# EAGLE design 6in-6out_1.0 (EAGLE 5.02)
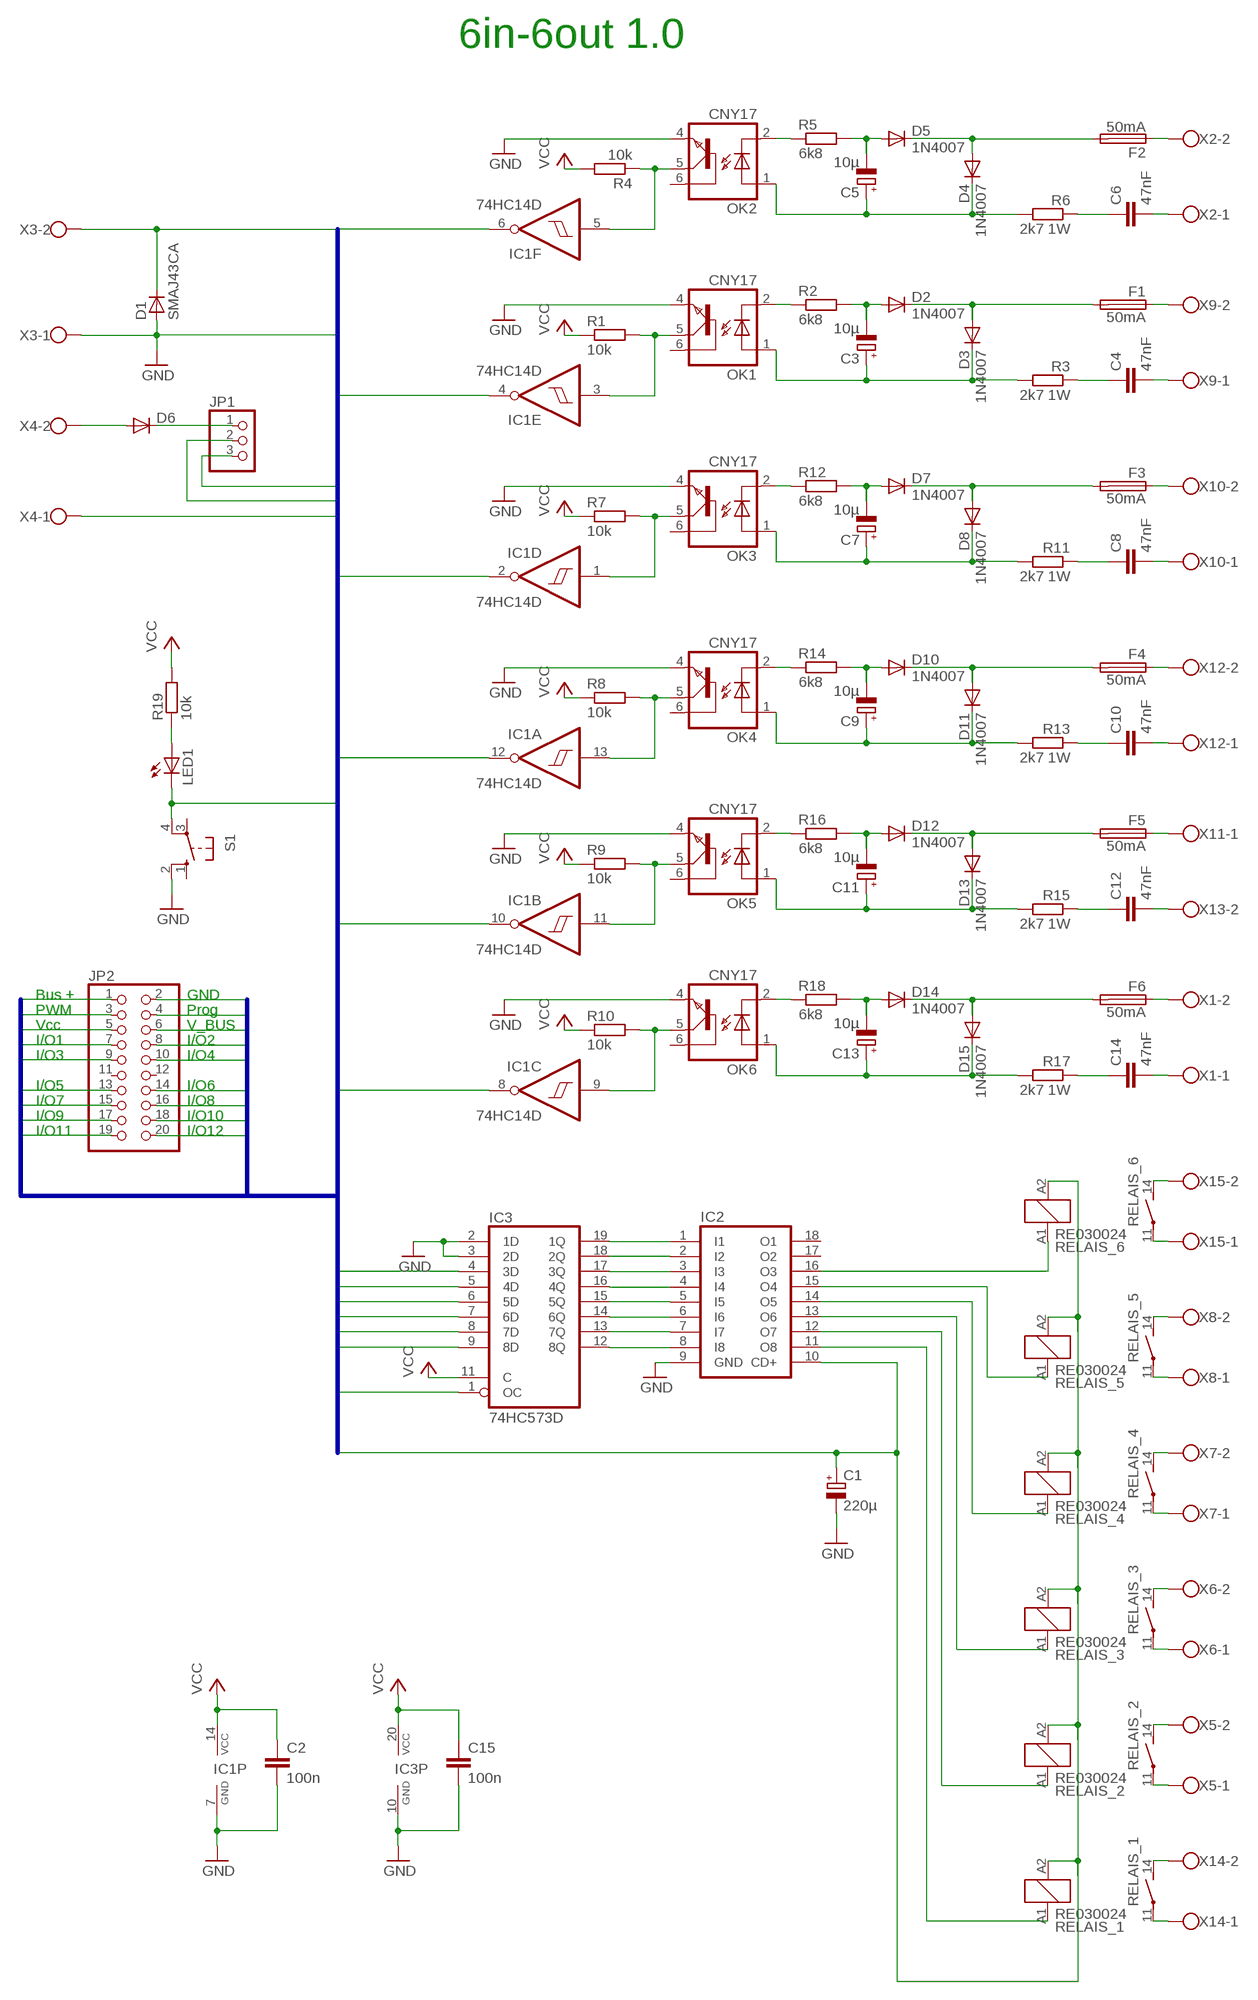
[diagram p0: schematic, sheet 1]

## Parts
C1  220µ  CPOL-EUE3.5-10  [E3,5-10]
C2  100n  C-EUC1206  [C1206]
C3  10µ  CPOL-EUE2-4  [E2-4]
C4  47nF  C-EU075-063X106  [C075-063X106]
C5  10µ  CPOL-EUE2-4  [E2-4]
C6  47nF  C-EU075-063X106  [C075-063X106]
C7  10µ  CPOL-EUE2-4  [E2-4]
C8  47nF  C-EU075-063X106  [C075-063X106]
C9  10µ  CPOL-EUE2-4  [E2-4]
C10  47nF  C-EU075-063X106  [C075-063X106]
C11  10µ  CPOL-EUE2-4  [E2-4]
C12  47nF  C-EU075-063X106  [C075-063X106]
C13  10µ  CPOL-EUE2-4  [E2-4]
C14  47nF  C-EU075-063X106  [C075-063X106]
C15  100n  C-EUC1206  [C1206]
D1  SMAJ43CA  D-SMB  [SMB]
D2  1N4007  DIODE-D-2.5  [D-2.5]
D3  1N4007  DIODE-D-2.5  [D-2.5]
D4  1N4007  DIODE-D-2.5  [D-2.5]
D5  1N4007  DIODE-D-2.5  [D-2.5]
D6  DIODE-MINIMELF  [MINIMELF]
D7  1N4007  DIODE-D-2.5  [D-2.5]
D8  1N4007  DIODE-D-2.5  [D-2.5]
D10  1N4007  DIODE-D-2.5  [D-2.5]
D11  1N4007  DIODE-D-2.5  [D-2.5]
D12  1N4007  DIODE-D-2.5  [D-2.5]
D13  1N4007  DIODE-D-2.5  [D-2.5]
D14  1N4007  DIODE-D-2.5  [D-2.5]
D15  1N4007  DIODE-D-2.5  [D-2.5]
F1  50mA  FUSE  [0617V]
F2  50mA  FUSE  [0617V]
F3  50mA  FUSE  [0617V]
F4  50mA  FUSE  [0617V]
F5  50mA  FUSE  [0617V]
F6  50mA  FUSE  [0617V]
IC1  74HC14D  [SO14]
IC2  ULN2803AD  [SO18W]
IC3  74HC573D  [SO20W]
JP1  PINHD-1X3  [1X03]
JP2  PINHD-2X10  [2X10]
LED1  LED3MM  [LED3MM]
OK1  CNY17  [DIL06]
OK2  CNY17  [DIL06]
OK3  CNY17  [DIL06]
OK4  CNY17  [DIL06]
OK5  CNY17  [DIL06]
OK6  CNY17  [DIL06]
R1  10k  R-EU_M1206  [M1206]
R2  6k8  R-EU_0207/2V  [0207/2V]
R3  2k7 1W  R-EU_0207/2V  [0207/2V]
R4  10k  R-EU_M1206  [M1206]
R5  6k8  R-EU_0207/2V  [0207/2V]
R6  2k7 1W  R-EU_0207/2V  [0207/2V]
R7  10k  R-EU_M1206  [M1206]
R8  10k  R-EU_M1206  [M1206]
R9  10k  R-EU_M1206  [M1206]
R10  10k  R-EU_M1206  [M1206]
R11  2k7 1W  R-EU_0207/2V  [0207/2V]
R12  6k8  R-EU_0207/2V  [0207/2V]
R13  2k7 1W  R-EU_0207/2V  [0207/2V]
R14  6k8  R-EU_0207/2V  [0207/2V]
R15  2k7 1W  R-EU_0207/2V  [0207/2V]
R16  6k8  R-EU_0207/2V  [0207/2V]
R17  2k7 1W  R-EU_0207/2V  [0207/2V]
R18  6k8  R-EU_0207/2V  [0207/2V]
R19  10k  R-EU_M1206  [M1206]
RELAIS_1  RE030024  [RE-SCHRACK]
RELAIS_2  RE030024  [RE-SCHRACK]
RELAIS_3  RE030024  [RE-SCHRACK]
RELAIS_4  RE030024  [RE-SCHRACK]
RELAIS_5  RE030024  [RE-SCHRACK]
RELAIS_6  RE030024  [RE-SCHRACK]
S1  10-XX  [B3F-10XX]
X1  W237-02P  [W237-132]
X2  W237-3E  [W237-3E]
X3  W237-02P  [W237-132]
X4  W237-02P  [W237-132]
X5  W237-02P  [W237-132]
X6  W237-02P  [W237-132]
X7  W237-02P  [W237-132]
X8  W237-02P  [W237-132]
X9  W237-3E  [W237-3E]
X10  W237-3E  [W237-3E]
X11  W237-02P  [W237-132]
X12  W237-02P  [W237-132]
X13  W237-02P  [W237-132]
X14  W237-02P  [W237-132]
X15  W237-02P  [W237-132]

## Nets
EIB+: D1.1(C) JP2.1 X3.2
GND: C1.- C2.2 C15.2 D1.2(A) IC1.7(P:GND) IC2.9(GND) IC3.2(1D) IC3.3(2D) IC3.10(GND) JP2.2 OK1.4(EMI) OK2.4(EMI) OK3.4(EMI) OK4.4(EMI) OK5.4(EMI) OK6.4(EMI) S1.2(S1) X3.1 X4.1
IO1: IC3.4(3D) JP2.7
IO2: IC3.5(4D) JP2.8
IO3: IC3.6(5D) JP2.9
IO4: IC3.7(6D) JP2.10
IO5: IC3.8(7D) JP2.13
IO6: IC3.9(8D) JP2.14
IO7: IC1.6(F:O) JP2.15
IO8: IC1.4(E:O) JP2.16
IO9: IC1.2(D:O) JP2.17
IO10: IC1.12(A:O) JP2.18
IO11: IC1.10(B:O) JP2.19
IO12: IC1.8(C:O) JP2.20
N$1: OK1.2(C) R2.1
N$2: LED1.A R19.1
N$3: C3.- D2.A R2.2
N$4: OK3.2(C) R12.1
N$5: D2.C D3.A F1.2
N$6: RELAIS_6.14(2:S) X15.2
N$7: C4.1 R3.1
N$8: C7.- D7.A R12.2
N$9: D7.C D8.A F3.2
N$10: OK2.2(C) R5.1
N$11: C6.1 R6.1
N$12: D6.A X4.2
N$13: C5.- D5.A R5.2
N$14: IC2.16(O3) RELAIS_6.A1
N$15: D6.C JP1.1
N$17: IC2.15(O4) RELAIS_5.A1
N$18: D4.A D5.C F2.2
N$19: IC2.12(O7) RELAIS_2.A1
N$20: C5.+ D4.C OK2.1(A) R6.2
N$21: IC2.1(I1) IC3.19(1Q)
N$22: IC2.2(I2) IC3.18(2Q)
N$23: C7.+ D8.C OK3.1(A) R11.2
N$24: C3.+ D3.C OK1.1(A) R3.2
N$25: RELAIS_6.11(2:P) X15.1
N$26: RELAIS_5.14(2:S) X8.2
N$27: IC1.1(D:I) OK3.5(COL) R7.2
N$28: IC1.5(F:I) OK2.5(COL) R4.1
N$29: IC1.3(E:I) OK1.5(COL) R1.2
N$30: RELAIS_5.11(2:P) X8.1
N$31: C8.1 R11.1
N$32: RELAIS_4.14(2:S) X7.2
N$33: OK4.2(C) R14.1
N$34: C9.- D10.A R14.2
N$35: D10.C D11.A F4.2
N$36: C9.+ D11.C OK4.1(A) R13.2
N$37: IC1.13(A:I) OK4.5(COL) R8.2
N$38: C10.1 R13.1
N$39: RELAIS_4.11(2:P) X7.1
N$40: RELAIS_3.14(2:S) X6.2
N$41: OK5.2(C) R16.1
N$42: C11.- D12.A R16.2
N$43: D12.C D13.A F5.2
N$44: C11.+ D13.C OK5.1(A) R15.2
N$45: IC1.11(B:I) OK5.5(COL) R9.2
N$46: RELAIS_3.11(2:P) X6.1
N$47: RELAIS_2.14(2:S) X5.2
N$48: C12.1 R15.1
N$49: OK6.2(C) R18.1
N$50: C13.- D14.A R18.2
N$51: D14.C D15.A F6.2
N$52: C13.+ D15.C OK6.1(A) R17.2
N$53: IC1.9(C:I) OK6.5(COL) R10.2
N$54: RELAIS_2.11(2:P) X5.1
N$55: RELAIS_1.14(2:S) X14.2
N$56: C14.1 R17.1
N$57: RELAIS_1.11(2:P) X14.1
N$58: F1.1 X9.2
N$59: IC2.3(I3) IC3.17(3Q)
N$60: IC2.13(O6) RELAIS_3.A1
N$61: IC2.4(I4) IC3.16(4Q)
N$62: F2.1 X2.2
N$63: C6.2 X2.1
N$64: IC2.5(I5) IC3.15(5Q)
N$65: IC2.14(O5) RELAIS_4.A1
N$66: IC2.6(I6) IC3.14(6Q)
N$67: C4.2 X9.1
N$68: F3.1 X10.2
N$69: IC2.7(I7) IC3.13(7Q)
N$70: IC2.8(I8) IC3.12(8Q)
N$71: C8.2 X10.1
N$72: F4.1 X12.2
N$73: C10.2 X12.1
N$74: C12.2 X13.2
N$75: F5.1 X11.1
N$76: F6.1 X1.2
N$77: C14.2 X1.1
PROG: JP2.4 LED1.K(C) S1.4(P1)
PWM: IC3.1(OC) JP2.3
R3: IC2.11(O8) RELAIS_1.A1
V_BUS: JP1.3 JP2.6
VCC: C2.1 C15.1 IC1.14(P:VCC) IC3.11(C) IC3.20(VCC) JP2.5 R1.1 R4.2 R7.1 R8.1 R9.1 R10.1 R19.2
VDD: C1.+ IC2.10(CD+) JP1.2 RELAIS_1.A2 RELAIS_2.A2 RELAIS_3.A2 RELAIS_4.A2 RELAIS_5.A2 RELAIS_6.A2
Unconnected: IC2.17(O2) IC2.18(O1) JP2.11 JP2.12 OK1.6(BAS) OK2.6(BAS) OK3.6(BAS) OK4.6(BAS) OK5.6(BAS) OK6.6(BAS) S1.1(S) S1.3(P) X2.3 X9.3 X10.3 X11.2 X13.1

## Buses
IO[1..12],PWM,PROG,VDD,VCC,GND,EIB+,V_BUS

## Notes on the sheet
- 6in-6out 1.0
- Bus + | GND
- PWM | Prog
- Vcc | V_BUS
- I/O1 | I/O2
- I/O3 | I/O4
- I/O5 | I/O6
- I/O7 | I/O8
- I/O9 | I/O10
- I/O11 | I/O12

## Library data of the parts
C1 C3 C5 C7 C9 C11 C13 = rcl:CPOL-EU: POLARIZED CAPACITOR, European symbol
C2 C4 C6 C8 C10 C12 C14 C15 = rcl:C-EU: CAPACITOR, European symbol
D1 = semicon-smd-ipc:D-: DIODE unfilled
D2-D8 D10-D15 = diode:DIODE-: DIODE
F1-F6 = fuse:FUSE: Fuse
IC1 = 74xx-eu:74*14: Hex schmitt trigger INVERTER
IC2 = uln-udn:ULN2803A: DRIVER ARRAY
IC3 = 74xx-eu:74*573: 8-bit D latch BUS DRIVER
JP1 = pinhead:PINHD-1X3: PIN HEADER
JP2 = pinhead:PINHD-2X10: PIN HEADER
LED1 = led:LED: LED OSRAM: - CHIPLED LG R971, LG N971, LY N971, LG Q971, LY Q971, LO R971, LY R971 LH N974, LH R974 LS Q976, LO Q976, LY Q976 LO Q996 - Hyper CHIPLED LW Q18S LB Q993, LB Q99A, LB R99A - SideLED LS A670, LO A670, LY A670, LG A670, LP A670 LB A673, LV A673, LT A673, LW A673 LH A674 LY A675 LS A676, LA A676, LO A676, LY A676, LW A676 LS A679, LY A679, LG A679 - Hyper Micro SIDELED® LS Y876, LA Y876, LO Y876, LY Y876 LT Y87S - SmartLED LW L88C, LW L88S LB L89C, LB L89S, LG L890 LS L89K, LO L89K, LY L89K LS L896, LA L896, LO L896, LY L896 - TOPLED LS T670, LO T670, LY T670, LG T670, LP T670 LSG T670, LSP T670, LSY T670, LOP T670, LYG T670 LG T671, LOG T671, LSG T671 LB T673, LV T673, LT T673, LW T673 LH T674 LS T676, LA T676, LO T676, LY T676, LB T676, LH T676, LSB T676, LW T676 LB T67C, LV T67C, LT T67C, LS T67K, LO T67K, LY T67K, LW E67C LS E67B, LA E67B, LO E67B, LY E67B, LB E67C, LV E67C, LT E67C LW T67C LS T679, LY T679, LG T679 LS T770, LO T770, LY T770, LG T770, LP T770 LB T773, LV T773, LT T773, LW T773 LH T774 LS E675, LA E675, LY E675, LS T675 LS T776, LA T776, LO T776, LY T776, LB T776 LHGB T686 LT T68C, LB T68C - Hyper Mini TOPLED® LB M676 - Mini TOPLED Santana® LG M470 LS M47K, LO M47K, LY M47K Source: http://www.osram.convergy.de - LUMILED® LXK2-PW12-R00, LXK2-PW12-S00, LXK2-PW14-U00, LXK2-PW14-V00 LXK2-PM12-R00, LXK2-PM12-S00, LXK2-PM14-U00 LXK2-PE12-Q00, LXK2-PE12-R00, LXK2-PE12-S00, LXK2-PE14-T00, LXK2-PE14-U00 LXK2-PB12-K00, LXK2-PB12-L00, LXK2-PB12-M00, LXK2-PB14-N00, LXK2-PB14-P00, LXK2-PB14-Q00 LXK2-PR12-L00, LXK2-PR12-M00, LXK2-PR14-Q00, LXK2-PR14-R00 LXK2-PD12-Q00, LXK2-PD12-R00, LXK2-PD12-S00 LXK2-PH12-R00, LXK2-PH12-S00 LXK2-PL12-P00, LXK2-PL12-Q00, LXK2-PL12-R00 Source: www.luxeon.com
OK1-OK6 = optocoupler:CNY17: SIEMENS OPTO COUPLER
R1-R19 = rcl:R-EU_: RESISTOR, European symbol
RELAIS_1-RELAIS_6 = relay:RE03*: Miniature PCB Relay 1 pole 6 A SCHRACK Source: http://www.schrack.com/.. 5812.pdf
S1 = switch-omron:10-XX: OMRON SWITCH
X1 X3-X8 X11-X15 = con-wago-508:W237-02P: WAGO SREW CLAMP
X2 X9 X10 = con-wago-508:W237-3E: WAGO SREW CLAMP

## Board
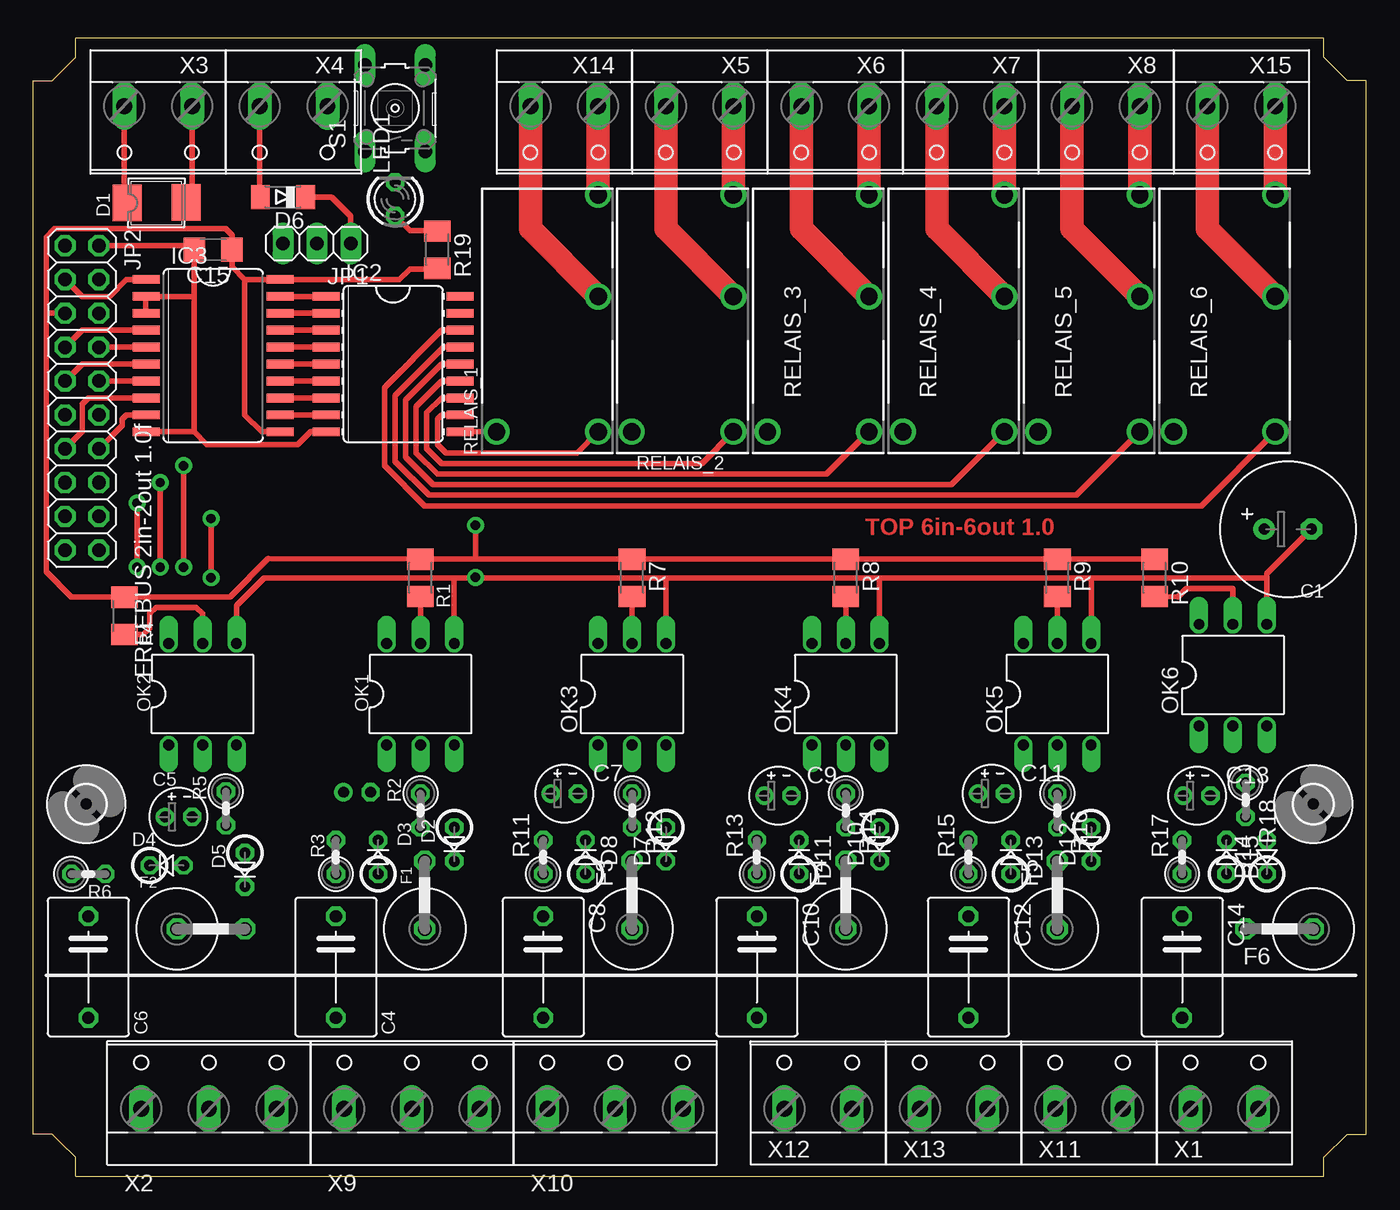
[diagram p1: board, top side]
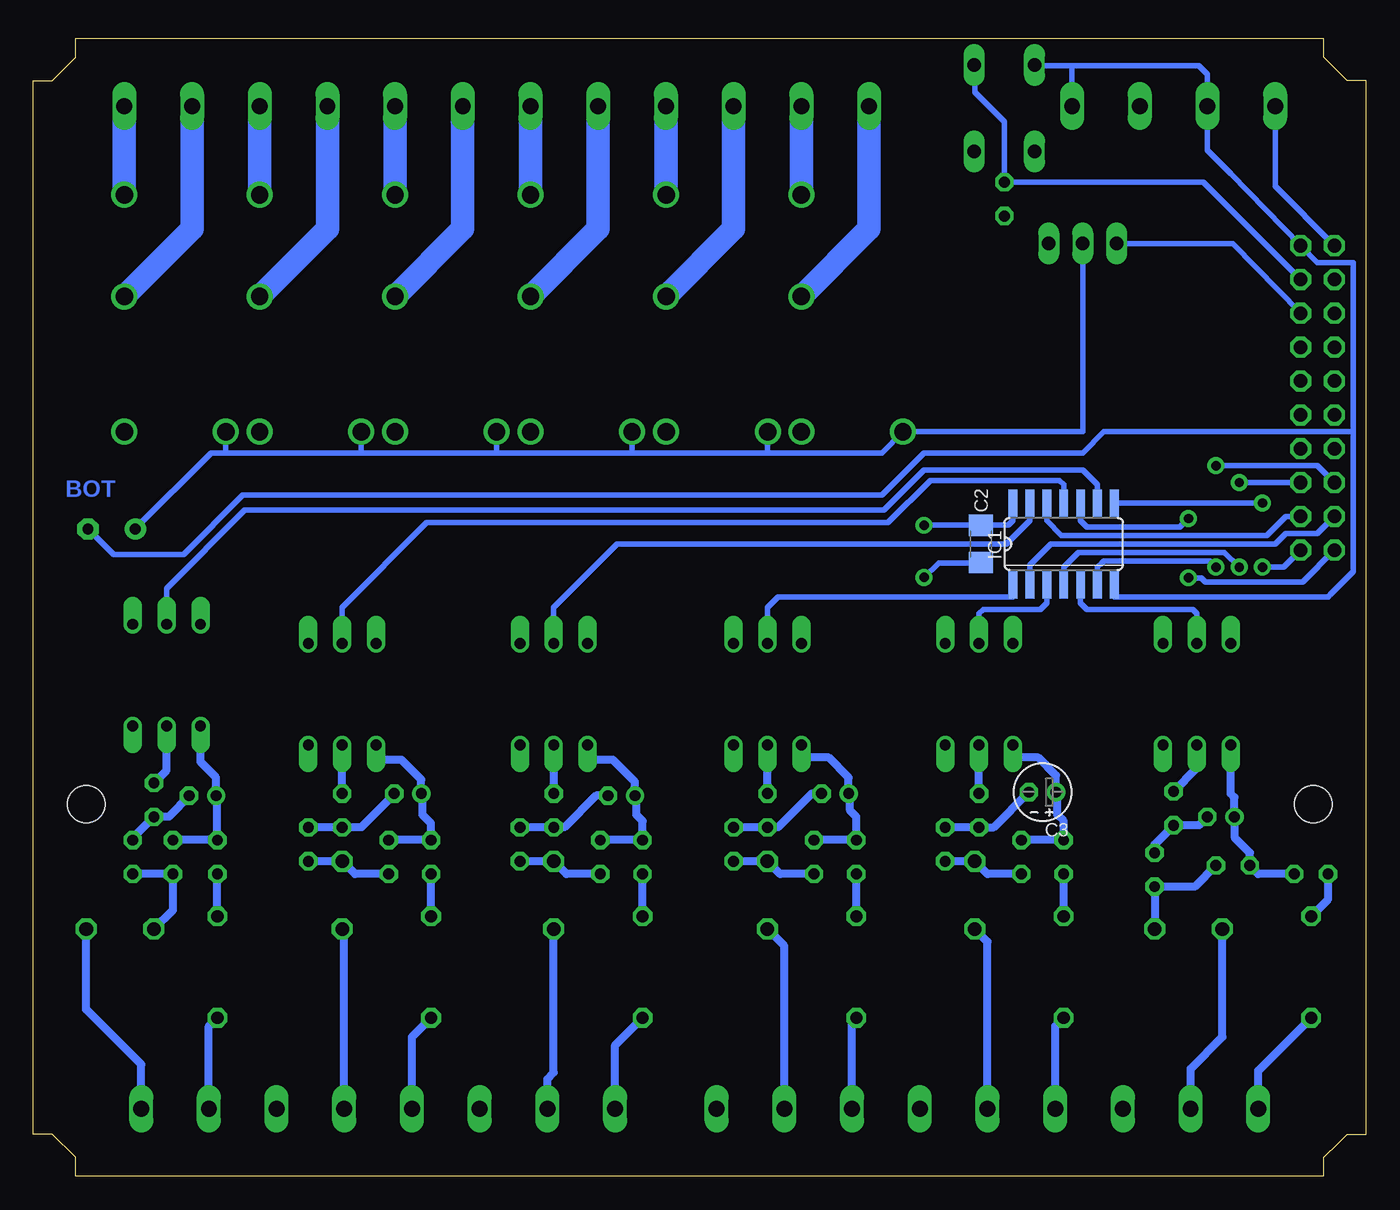
[diagram p2: board, bottom side, seen from below]

Size 100.01 x 85.41 mm. Coordinates in mm from the lower left corner, seen from the top.
Outline: 3.17,0 3.17,1.43 2.06,2.54 1.43,3.17 0,3.17 0,82.23 1.43,82.23 2.22,83.03 3.17,83.98 3.17,85.41 96.84,85.41 96.84,83.98 98.58,82.23 100.01,82.23 100.01,3.17 98.58,3.17 96.84,1.43 96.84,0 3.17,0
Copper layers (1*16): Top 0.035mm / dielectric 1.5mm / Bottom 0.035mm
Design rules "default_freebus": minimum track width 10mil, minimum drill 24mil, track to track 8mil, track to pad 8mil, pad to pad 8mil, via to via 8mil, smd to smd 8mil, copper to edge 12mil, drill to drill 8mil, minimum pad ring 11mil, minimum via ring 8mil, stop-mask expansion 4mil, vias tented up to drill 0mil, thermal gap 10mil

### Footprints (pad centres in the part's own frame; a part is rotated, then mirrored left to right if it is on the bottom)
E3,5-10 = drill 0.813 pad 1.6 round: + -1.778,0 | drill 0.813 pad 1.6 octagon: - 1.778,0
C1206 = smd 1.6 x 1.8: 1 -1.4,0; 2 1.4,0
E2-4 = drill 0.813 pad 1.27 round: + -1.016,0 | drill 0.813 pad 1.27 octagon: - 1.016,0
C075-063X106 = drill 0.914 octagon: 1 -3.81,0; 2 3.81,0
SMB = smd 2.159 x 2.743: 1 -2.311,-0.127; 2 2.108,-0.102
D-2.5 = drill 0.813 octagon: A 1.27,0; C -1.27,0
MINIMELF = smd 1.4 x 1.8: A 1.7,0; C -1.7,0
0617V = drill 1.016 octagon: 1 -2.54,0; 2 2.54,0
SO14 = smd 0.66 x 2.032: 1 -3.81,-3.073; 2 -2.54,-3.073; 3 -1.27,-3.073; 4 0,-3.073; 5 1.27,-3.073; 6 2.54,-3.073; 7 3.81,-3.073; 8 3.81,3.073; 9 2.54,3.073; 10 1.27,3.073; 11 0,3.073; 12 -1.27,3.073; 13 -2.54,3.073; 14 -3.81,3.073
SO18W = smd 0.66 x 2.032: 1 -5.08,-5.029; 2 -3.81,-5.029; 3 -2.54,-5.029; 4 -1.27,-5.029; 5 0,-5.029; 6 1.27,-5.029; 7 2.54,-5.029; 8 3.81,-5.029; 9 5.08,-5.029; 10 5.08,5.029; 11 3.81,5.029; 12 2.54,5.029; 13 1.27,5.029; 14 0,5.029; 15 -1.27,5.029; 16 -2.54,5.029; 17 -3.81,5.029; 18 -5.08,5.029
SO20W = smd 0.66 x 2.032: 1 -5.715,-5.029; 2 -4.445,-5.029; 3 -3.175,-5.029; 4 -1.905,-5.029; 5 -0.635,-5.029; 6 0.635,-5.029; 7 1.905,-5.029; 8 3.175,-5.029; 9 4.445,-5.029; 10 5.715,-5.029; 11 5.715,5.029; 12 4.445,5.029; 13 3.175,5.029; 14 1.905,5.029; 15 0.635,5.029; 16 -0.635,5.029; 17 -1.905,5.029; 18 -3.175,5.029; 19 -4.445,5.029; 20 -5.715,5.029
1X03 = drill 1.016 long: 1 -2.54,0; 2 0,0; 3 2.54,0
2X10 = drill 1.016 octagon: 1 -11.43,-1.27; 2 -11.43,1.27; 3 -8.89,-1.27; 4 -8.89,1.27; 5 -6.35,-1.27; 6 -6.35,1.27; 7 -3.81,-1.27; 8 -3.81,1.27; 9 -1.27,-1.27; 10 -1.27,1.27; 11 1.27,-1.27; 12 1.27,1.27; 13 3.81,-1.27; 14 3.81,1.27; 15 6.35,-1.27; 16 6.35,1.27; 17 8.89,-1.27; 18 8.89,1.27; 19 11.43,-1.27; 20 11.43,1.27
LED3MM = drill 0.813 octagon: A -1.27,0; K 1.27,0
DIL06 = drill 0.813 offset: 1 -2.54,-3.81; 2 0,-3.81; 3 2.54,-3.81; 4 2.54,3.81; 5 0,3.81; 6 -2.54,3.81
M1206 = smd 1.6 x 2: 1 -1.4,0; 2 1.4,0
0207/2V = drill 0.813 octagon: 1 -1.27,0; 2 1.27,0
RE-SCHRACK = drill 1.3 round: 11 8.89,-3.81; 14 1.27,-3.81; A1 -8.89,-3.81; A2 -8.89,3.81
B3F-10XX = drill 1.016 long: 1 -3.251,2.261; 2 3.251,2.261; 3 -3.251,-2.261; 4 3.251,-2.261
2,8 = hole 2.8: 0,0
W237-132 = drill 1.194 long: 1 -2.54,-0.635; 2 2.54,-0.635
W237-3E = drill 1.194 long: 1 -5.08,-0.635; 2 0,-0.635; 3 5.08,-0.635

### Placement (x,y rotation side)
C1  94.14,48.58 0 top
C2  28.89,47.47 270 bottom
C3  24.29,28.84 180 bottom
C4  22.7,15.72 270 top
C5  10.9,26.99 0 top
C6  4.13,15.72 270 top
C7  39.85,28.73 0 top
C8  38.26,15.72 270 top
C9  55.88,28.58 0 top
C10  54.29,15.72 270 top
C11  71.91,28.73 0 top
C12  70.17,15.72 270 top
C13  87.31,28.58 0 top
C14  86.2,15.72 270 top
C15  13.49,69.53 180 top
D1  9.37,73.18 0 top
D2  31.59,24.92 90 top
D3  25.88,23.97 270 top
D4  10,23.34 0 top
D5  15.88,23.02 90 top
D6  18.73,73.5 180 top
D7  47.47,24.92 90 top
D8  41.43,23.97 270 top
D10  63.5,24.92 90 top
D11  57.47,23.97 270 top
D12  79.38,24.92 90 top
D13  73.34,23.97 270 top
D14  92.55,23.97 90 top
D15  89.53,23.97 270 top
F1  29.37,21.11 90 top
F2  13.33,18.57 0 top
F3  44.93,21.11 90 top
F4  60.96,21.11 90 top
F5  76.83,21.11 90 top
F6  93.5,18.57 180 top
IC1  22.7,47.47 0 bottom
IC2  26.99,60.96 270 top
IC3  13.49,61.6 270 top
JP1  21.27,70.01 180 top
JP2  3.65,58.42 270 top
LED1  27.15,73.34 90 top
OK1  29.05,36.19 0 top
OK2  12.7,36.19 0 top
OK3  44.93,36.19 0 top
OK4  60.96,36.19 0 top
OK5  76.83,36.19 0 top
OK6  90.01,37.62 0 top
R1  29.05,44.93 270 top
R2  29.05,27.46 270 top
R3  22.7,23.97 90 top
R4  6.83,42.07 90 top
R5  14.45,27.62 270 top
R6  4.13,22.7 0 top
R7  44.93,44.93 270 top
R8  60.96,44.93 270 top
R9  76.84,44.93 270 top
R10  84.14,44.93 270 top
R11  38.26,23.97 90 top
R12  44.93,27.46 270 top
R13  54.29,23.97 90 top
R14  60.96,27.46 270 top
R15  70.17,23.97 90 top
R16  76.83,27.46 270 top
R17  86.2,23.97 90 top
R18  90.96,28.26 270 top
R19  30.32,69.53 270 top
RELAIS_1  38.58,64.77 90 top
RELAIS_2  48.71,64.77 90 top
RELAIS_3  58.9,64.77 90 top
RELAIS_4  69.06,64.77 90 top
RELAIS_5  79.22,64.77 90 top
RELAIS_6  89.38,64.77 90 top
S1  27.15,80.17 90 top
U$1  [2,8]  3.97,27.94 0 top
U$3  [2,8]  96.04,27.94 0 top
X1  89.38,5.72 0 top
X2  13.18,5.72 0 top
X3  9.37,79.69 180 top
X4  19.53,79.69 180 top
X5  50.01,79.69 180 top
X6  60.17,79.69 180 top
X7  70.33,79.69 180 top
X8  80.49,79.69 180 top
X9  28.42,5.72 0 top
X10  43.66,5.72 0 top
X11  79.22,5.72 0 top
X12  58.9,5.72 0 top
X13  69.06,5.72 0 top
X14  39.85,79.69 180 top
X15  90.65,79.69 180 top

### Tracks (layer width: path | path; a pad name or v marks a point on that pad's centre or on a via)
EIB+
  Top 0.406: X3.2 | D1.1 6.83,73.06 X3.2
  Bottom 0.406: JP2.1 | 6.83,76.36 6.83,74.29 JP2.1 | 6.83,76.36 | X3.2 | 6.83,76.36 X3.2
GND  (via drill 0.7 pad 1.27)
  Top 0.406: OK6.4 92.55,42.86 92.55,44.93 | OK5.4 | 92.55,44.93 79.38,44.93 | 79.38,44.93 OK5.4 | OK4.4 | 63.5,44.93 OK4.4 | 79.38,44.93 63.5,44.93 | OK3.4 | 47.47,44.93 OK3.4 | 63.5,44.93 47.47,44.93 | OK1.4 | OK2.4 | OK2.4 15.24,42.86 17.3,44.93 17.78,44.93 31.59,44.93 | 31.59,44.93 OK1.4 | IC3.10 8.57,55.88 12.06,55.88 | IC2.9 20.8,55.88 19.84,54.93 13.02,54.93 12.06,55.88 | 12.06,55.88 | 12.06,69.53 12.06,66.04 | 12.06,66.04 12.06,55.88 | 12.06,69.53 C15.2 | JP2.2 12.06,69.85 12.06,69.53 | 92.55,44.93 92.55,45.24 95.89,48.58 C1.- | X3.1 | D1.2 11.91,73.08 X3.1 | 8.41,64.77 | 8.41,64.77 IC3.3 | 8.41,64.77 8.41,66.04 IC3.2 12.06,66.04 | 47.47,44.93 33.18,44.93 | 33.18,44.93 v33.18,44.96 | 33.18,44.93 31.59,44.93 | 33.18,44.93
  Bottom 0.406: 0.95,55.88 0.95,45.4 2.7,43.66 2.86,43.5 18.89,43.5 IC1.7 | 0.95,55.88 0.95,68.58 3.65,68.58 JP2.2 | 0.95,55.88 19.68,55.88 21.27,54.29 33.18,54.29 36.35,51.12 84.3,51.12 88.74,46.67 93.98,46.67 95.89,48.58 C1.- | JP2.2 | JP2.2 10.16,75.25 11.91,76.99 X3.1 | X3.1 | X4.1 | S1.2 24.92,83.42 24.92,83.34 22.07,83.34 | X3.1 11.91,82.71 12.54,83.34 22.07,83.34 | 22.07,83.34 X4.1 | IC1.7 18.89,44.45 | IC1.7 | C2.2 28.89,46.04 32.07,46.04 v33.18,44.96
IO1
  Top 0.406: JP2.7 | IC3.4 3.65,63.5 JP2.7
IO2
  Top 0.406: JP2.8 | IC3.5 JP2.8
IO3
  Top 0.406: JP2.9 | IC3.6 3.65,60.96 JP2.9
IO4
  Top 0.406: IC3.7 8.41,59.69 JP2.10
IO5
  Top 0.406: IC3.8 4.13,58.42 3.65,57.94 3.65,55.88 JP2.13 | JP2.13
IO6
  Top 0.406: IC3.9 6.99,57.15 6.67,56.83 6.67,56.36 5.87,55.56 JP2.14
IO7  (via drill 0.7 pad 1.27)
  Top 0.406: v11.27,53.34 v11.27,45.72
  Bottom 0.406: IC1.6 20.16,44.71 20.16,45.72 19.84,46.04 19.68,46.2 11.75,46.2 v11.27,45.72 | v11.27,45.72 | JP2.15 | JP2.15 3.65,53.34 v11.27,53.34
IO8  (via drill 0.7 pad 1.27)
  Top 0.406: v9.53,45.72 v9.53,52.07
  Bottom 0.406: IC1.4 22.7,44.71 22.7,45.72 21.59,46.83 21.43,46.83 10.64,46.83 v9.53,45.72 | JP2.16 v9.53,52.07 9.37,52.07
IO9
  Bottom 0.406: IC1.2 25.24,44.71 25.24,45.88 23.65,47.47 6.83,47.47 6.03,48.26 3.65,48.26 JP2.17 | JP2.17
IO10
  Bottom 0.406: IC1.12 23.97,50.86 23.97,49.21 22.86,48.1 22.54,48.1 7.46,48.1 6.03,49.53 JP2.18
IO11  (via drill 0.7 pad 1.27)
  Top 0.406: v13.34,44.93 v13.34,49.37
  Bottom 0.406: IC1.10 21.43,50.86 21.43,49.21 20.95,48.74 13.97,48.74 v13.34,49.37 | JP2.19 | JP2.19 4.76,44.61 12.06,44.61 12.38,44.93 v13.34,44.93
IO12  (via drill 0.7 pad 1.27)
  Top 0.406: v7.78,45.72 v7.78,50.54
  Bottom 0.406: JP2.20 6.19,45.72 | 6.19,45.72 | 6.19,45.72 v7.78,45.72 | v7.78,50.54 IC1.8
N$1
  Bottom 0.61: OK1.2 | OK1.2 | R2.1 OK1.2 | OK1.2
N$2
  Top 0.406: LED1.A 28.26,70.96 30.32,70.96 R19.1 | R19.1
N$3
  Bottom 0.61: 28.89,26.19 | 28.89,26.19 R2.2 27.94,26.19 C3.- | 28.89,26.19 D2.A | 28.89,26.19 | C3.- 25.24,28.89 | C3.-
N$4
  Bottom 0.61: R12.1 OK3.2 | OK3.2
N$5
  Bottom 0.61: F1.2 | D3.A 28.42,22.7 F1.2 | D2.C 31.43,23.65 F1.2
N$6
  Top 1.778: X15.2 88.11,71.12 RELAIS_6.14
  Bottom 1.778: RELAIS_6.14 88.11,71.12 X15.2
N$7
  Bottom 0.61: R3.1 | C4.1 R3.1 | R3.1
N$8
  Bottom 0.61: R12.2 D7.A | R12.2 | R12.2 44.13,26.19 41.59,28.73 40.8,28.73 | 40.8,28.73 | C7.- 40.8,28.73
N$9
  Bottom 0.61: F3.2 | D8.A 43.97,22.7 F3.2 | D7.C | F3.2 D7.C | D7.C
N$10
  Bottom 0.61: R5.1 | R5.1 12.7,30.64 OK2.2 | OK2.2 | OK2.2
N$11
  Bottom 0.61: C6.1 | C6.1 2.86,20.8 R6.1 | R6.1
N$12
  Top 0.406: X4.2 | D6.A 16.99,73.5 X4.2
N$13
  Bottom 0.61: R5.2 | R5.2 | D5.A 15.88,24.92 R5.2 | 11.91,26.99 | C5.- 11.91,26.99 | R5.2 12.54,26.35 11.91,26.99
N$14
  Top 0.406: 30.64,63.5 26.35,59.21 26.35,53.34 29.37,50.32 87.63,50.32 RELAIS_6.A1 | 30.64,63.5 | 30.64,63.5 IC2.16
N$15
  Top 0.406: JP1.1 23.81,72.07 22.38,73.5 D6.C
N$17
  Top 0.406: 30.8,62.23 27.15,58.58 27.15,53.66 29.69,51.12 78.26,51.12 RELAIS_5.A1 | 30.8,62.23 | 30.8,62.23 IC2.15 | RELAIS_5.A1
N$18
  Bottom 0.61: D5.C | D5.C F2.2 | D5.C | D5.C 12.86,21.75 D4.A
N$19
  Top 0.406: 30.64,58.42 29.53,57.31 29.53,54.93 29.53,54.61 30.64,53.5 50.16,53.5 52.55,55.88 RELAIS_2.A1 | 30.64,58.42 | 30.64,58.42 IC2.12
N$20
  Bottom 0.61: R6.2 8.1,22.7 D4.C 8.73,24.29 9.84,25.4 9.84,26.99 C5.+ 9.89,28.46 10.16,28.73 OK2.1 | OK2.1 | OK2.1
N$21
  Top 0.406: IC3.19 18.41,66.04 IC2.1
N$22
  Top 0.406: IC3.18 18.41,64.77 IC2.2
N$23
  Bottom 0.61: D8.C 41.27,25.24 R11.2 38.26,26.99 38.73,27.46 38.73,28.73 | 38.73,28.73 | 38.73,28.73 C7.+ 38.83,29.94 40.32,31.43 42.39,31.43 OK3.1 | OK3.1
N$24
  Bottom 0.61: R3.2 | R3.2 | R3.2 D3.C | R3.2 22.7,26.67 23.18,27.15 23.18,28.73 23.27,28.83 C3.+ 23.27,30.1 24.61,31.43 26.51,31.43 OK1.1 | OK1.1 | OK1.1
N$25
  Top 1.778: X15.1 93.19,80.64 | 93.19,80.64 RELAIS_6.11 | 93.19,80.64
  Bottom 1.778: RELAIS_6.11 X15.1 93.19,80.64
N$26
  Top 1.778: X8.2 77.95,71.12 RELAIS_5.14
  Bottom 1.778: RELAIS_5.14 77.95,71.12 X8.2
N$27
  Top 0.406: OK3.5 | R7.2 | OK3.5 R7.2
  Bottom 0.406: OK3.5 | OK3.5 44.93,42.7 44.13,43.5 26.51,43.5 26.51,44.71 | 26.51,44.71 26.51,44.77 | 26.51,44.71 IC1.1
N$28
  Top 0.406: R4.1 8.26,40.67 8.73,41.12 8.73,42.23 9.21,42.7 12.22,42.7 12.7,42.23 OK2.5 | OK2.5
  Bottom 0.406: OK2.5 | OK2.5 12.7,42.23 13.02,42.54 20.95,42.54 21.43,43.02 21.43,44.71 | 21.43,44.71 21.43,44.77 | 21.43,44.71 IC1.5
N$29
  Top 0.406: OK1.5 R1.2
  Bottom 0.406: 23.97,44.71 23.97,44.77 | 23.97,44.71 IC1.3 | OK1.5 | OK1.5 29.05,42.23 28.73,42.54 24.45,42.54 23.97,43.02 23.97,44.71
N$30
  Top 1.778: X8.1 RELAIS_5.11
  Bottom 1.778: RELAIS_5.11 | RELAIS_5.11 X8.1
N$31
  Bottom 0.61: C8.1 R11.1 | R11.1
N$32
  Top 1.778: RELAIS_4.14 | RELAIS_4.14 67.79,71.12 X7.2
  Bottom 1.778: RELAIS_4.14 67.79,71.12 X7.2
N$33
  Bottom 0.61: OK4.2 | OK4.2 | OK4.2 R14.1
N$34
  Bottom 0.61: R14.2 D10.A | R14.2 | R14.2 60.17,26.19 57.78,28.57 56.83,28.57 | 56.83,28.57 | C9.- 56.83,28.57
N$35
  Bottom 0.61: F4.2 | D11.A 60.01,22.7 F4.2 | D10.C | F4.2 D10.C | D10.C
N$36
  Bottom 0.61: D11.C R13.2 54.29,26.67 54.77,27.15 54.77,28.57 | 54.77,28.57 | 54.77,28.57 C9.+ 54.86,29.62 56.52,31.27 58.42,31.27 OK4.1 | OK4.1 | OK4.1
N$37
  Top 0.406: OK4.5 | R8.2 | OK4.5 R8.2
  Bottom 0.406: IC1.13 25.24,50.86 25.24,49.21 26.99,47.47 56.2,47.47 60.96,42.7 OK4.5 | OK4.5
N$38
  Bottom 0.61: R13.1 C10.1
N$39
  Top 1.778: X7.1 | X7.1 RELAIS_4.11 | X7.1
  Bottom 1.778: RELAIS_4.11 X7.1
N$40
  Top 1.778: RELAIS_3.14 | RELAIS_3.14 57.63,71.12 57.63,77.95 X6.2 | X6.2 | X6.2
  Bottom 1.778: X6.2 | RELAIS_3.14 57.63,71.12 X6.2
N$41
  Bottom 0.61: OK5.2 | R16.1 OK5.2 | OK5.2
N$42
  Bottom 0.61: R16.2 | R16.2 D12.A | R16.2 | C11.- 72.87,28.73 75.41,26.19 R16.2
N$43
  Bottom 0.61: F5.2 D12.C | F5.2 | F5.2 | D13.A 75.88,22.7 F5.2
N$44
  Bottom 0.61: D13.C | D13.C R15.2 70.17,26.51 70.8,27.15 70.8,28.73 C11.+ 70.9,29.78 72.39,31.27 74.3,31.27 OK5.1 | OK5.1
N$45
  Top 0.406: OK5.5 | R9.2 | OK5.5 R9.2
  Bottom 0.406: IC1.11 22.7,50.86 22.7,51.91 23.02,52.23 | 23.02,52.23 | 23.02,52.23 32.7,52.23 35.88,49.05 70.48,49.05 76.83,42.7 OK5.5 | OK5.5
N$46
  Top 1.778: X6.1 | X6.1 RELAIS_3.11
  Bottom 1.778: X6.1 | RELAIS_3.11 | RELAIS_3.11 X6.1
N$47
  Top 1.778: 52.55,66.04 47.47,71.12 X5.2
  Bottom 1.778: RELAIS_2.14 47.47,71.12 X5.2
N$48
  Bottom 0.61: R15.1 | C12.1 R15.1
N$49
  Bottom 0.61: R18.1 90.01,30.48 OK6.2 | OK6.2
N$50
  Bottom 0.61: D14.A 92.55,25.4 R18.2 89.85,26.99 88.27,28.57 C13.-
N$51
  Bottom 0.61: D14.C D15.A | F6.2 | F6.2 89.53,20 D15.A | D15.A
N$52
  Bottom 0.61: 86.2,28.57 C13.+ 86.3,29.94 87.47,31.11 OK6.1 | 86.2,28.57 R17.2 D15.C | 86.2,28.57 | D15.C | D15.C | OK6.1
N$53
  Top 0.406: OK6.5 90.01,41.59 90.01,44.13 86.52,44.13 85.88,43.5 R10.2
  Bottom 0.406: IC1.9 20.16,50.86 20.16,51.91 21.27,53.02 33.18,53.02 36.2,50.01 84.14,50.01 90.01,44.13 90.01,41.75 OK6.5
N$54
  Top 1.778: X5.1 52.55,73.66 | X5.1
  Bottom 1.778: RELAIS_2.11 52.55,73.66 X5.1
N$55
  Top 1.778: X14.2 37.31,71.12 RELAIS_1.14
  Bottom 1.778: RELAIS_1.14 37.31,71.12 X14.2
N$56
  Bottom 0.61: C14.1 R17.1 | R17.1
N$57
  Top 1.778: X14.1 RELAIS_1.11
  Bottom 1.778: RELAIS_1.11 | RELAIS_1.11 X14.1
N$58
  Bottom 0.61: F1.1 | X9.2 28.42,17.62 F1.1
N$59
  Top 0.406: IC3.17 18.57,63.5 IC2.3
N$60
  Top 0.406: 30.64,59.69 28.73,57.78 28.73,54.29 30.32,52.7 59.53,52.7 RELAIS_3.A1 | 30.64,59.69 | 30.64,59.69 IC2.13 | RELAIS_3.A1
N$61
  Top 0.406: IC3.16 18.57,62.23 IC2.4
N$62
  Bottom 0.61: X2.2 13.18,8.1 10.79,10.48 F2.1 | F2.1
N$63
  Bottom 0.61: C6.2 | X2.1 8.1,7.94 C6.2
N$64
  Top 0.406: IC3.15 18.41,60.96 IC2.5
N$65
  Top 0.406: 30.64,60.96 27.94,58.26 27.94,54.29 27.94,53.97 30,51.91 68.9,51.91 RELAIS_4.A1 | 30.64,60.96 | 30.64,60.96 IC2.14
N$66
  Top 0.406: IC3.14 18.57,59.69 IC2.6
N$67
  Bottom 0.61: C4.2 | X9.1 23.34,11.27 C4.2
N$68
  Bottom 0.61: F3.1 | X10.2 43.66,17.3 F3.1
N$69
  Top 0.406: IC3.13 18.57,58.42 IC2.7
N$70
  Top 0.406: IC3.12 18.57,57.15 IC2.8
N$71
  Bottom 0.61: C8.2 | X10.1 38.58,11.59 C8.2
N$72
  Bottom 0.61: X12.2 61.44,7.3 60.96,7.78 F4.1
N$73
  Bottom 0.61: X12.1 56.36,9.84 C10.2
N$74
  Bottom 0.61: X13.2 71.6,10.48 C12.2
N$75
  Bottom 0.61: F5.1 | X11.1 76.68,18.41 F5.1
N$76
  Bottom 0.61: F6.1 96.04,12.54 91.92,8.41 X1.2 | X1.2 | X1.2
N$77
  Bottom 0.61: C14.2 | X1.1 86.84,11.27 C14.2
PROG
  Bottom 0.406: S1.4 29.37,83.34 29.37,81.36 27.15,79.13 LED1.K | JP2.4 12.22,74.61 15.88,74.61 LED1.K | LED1.K 27.15,74.45
PWM
  Top 0.406: IC3.1 6.99,67.31 5.71,66.04 3.65,66.04 JP2.3 | JP2.3 | JP2.3
R3
  Top 0.406: RELAIS_1.A1 | 30.64,57.15 30.32,56.83 30.32,54.93 30.96,54.29 40.8,54.29 RELAIS_1.A1 | 30.64,57.15 | 30.64,57.15 IC2.11
V_BUS
  Bottom 0.406: JP1.3 | JP1.3 | JP2.6 10,70.01 JP1.3
VCC  (via drill 0.7 pad 1.27)
  Top 0.406: 30.48,46.33 17.62,46.35 14.76,43.47 R4.2 6.83,43.63 6.83,43.5 2.86,43.5 0.95,45.4 0.95,64.77 | 30.48,46.33 R1.1 | 30.48,46.33 33.18,46.33 | 33.18,46.33 R7.1 61.28,46.33 | 61.28,46.33 | 61.28,46.33 R8.1 R9.1 R10.1 | 61.28,46.33 61.28,46.35 | R10.1 | JP2.5 | JP2.5 | 0.95,64.77 JP2.5 | 15.88,67.31 IC3.20 27.46,67.31 28.26,68.1 30.32,68.1 R19.2 | 0.95,64.77 0.95,70.48 1.59,71.12 14.45,71.12 14.92,70.64 14.92,69.69 | IC3.11 17.14,55.88 15.88,57.15 15.88,67.31 | 14.92,69.69 14.92,68.26 15.88,67.31 | 14.92,69.69 C15.1 | R19.2 | 33.18,46.33 v33.18,48.87
  Bottom 0.406: IC1.14 | IC1.14 26.51,49.21 26.83,48.89 28.89,48.89 C2.1 v33.18,48.87
VDD
  Top 0.406: RELAIS_1.A2 | RELAIS_1.A2 IC2.10 | RELAIS_1.A2
  Bottom 0.406: RELAIS_2.A2 44.93,55.88 44.93,54.29 | 44.93,54.29 36.35,54.29 RELAIS_1.A2 | RELAIS_3.A2 55.09,54.29 | 44.93,54.29 55.09,54.29 | 65.25,54.29 RELAIS_4.A2 | 55.09,54.29 65.25,54.29 | RELAIS_5.A2 | 75.41,54.29 RELAIS_5.A2 | 65.25,54.29 75.41,54.29 | 85.57,54.29 RELAIS_6.A2 | 75.41,54.29 85.57,54.29 | C1.+ 92.39,48.58 86.68,54.29 85.57,54.29 | JP1.2 | JP1.2 21.27,55.88 RELAIS_1.A2 | RELAIS_1.A2

### Text on the board
Top: TOP 6in-6out 1.0
Bottom: BOT
tNames: FREEBUS 2in-2out 1.0f